# Altium schematic sheet USB Power.SchDoc: =SheetTitle
size A4; CompanyName: Catcatcat Electronics; Engineer: Hena Chernov; SheetNumber: 10; SheetTotal: 10; CodePhone: +380505759863; SheetDescription: Power, USB-bridge.; Email: catcatcat.electronics@gmail.com
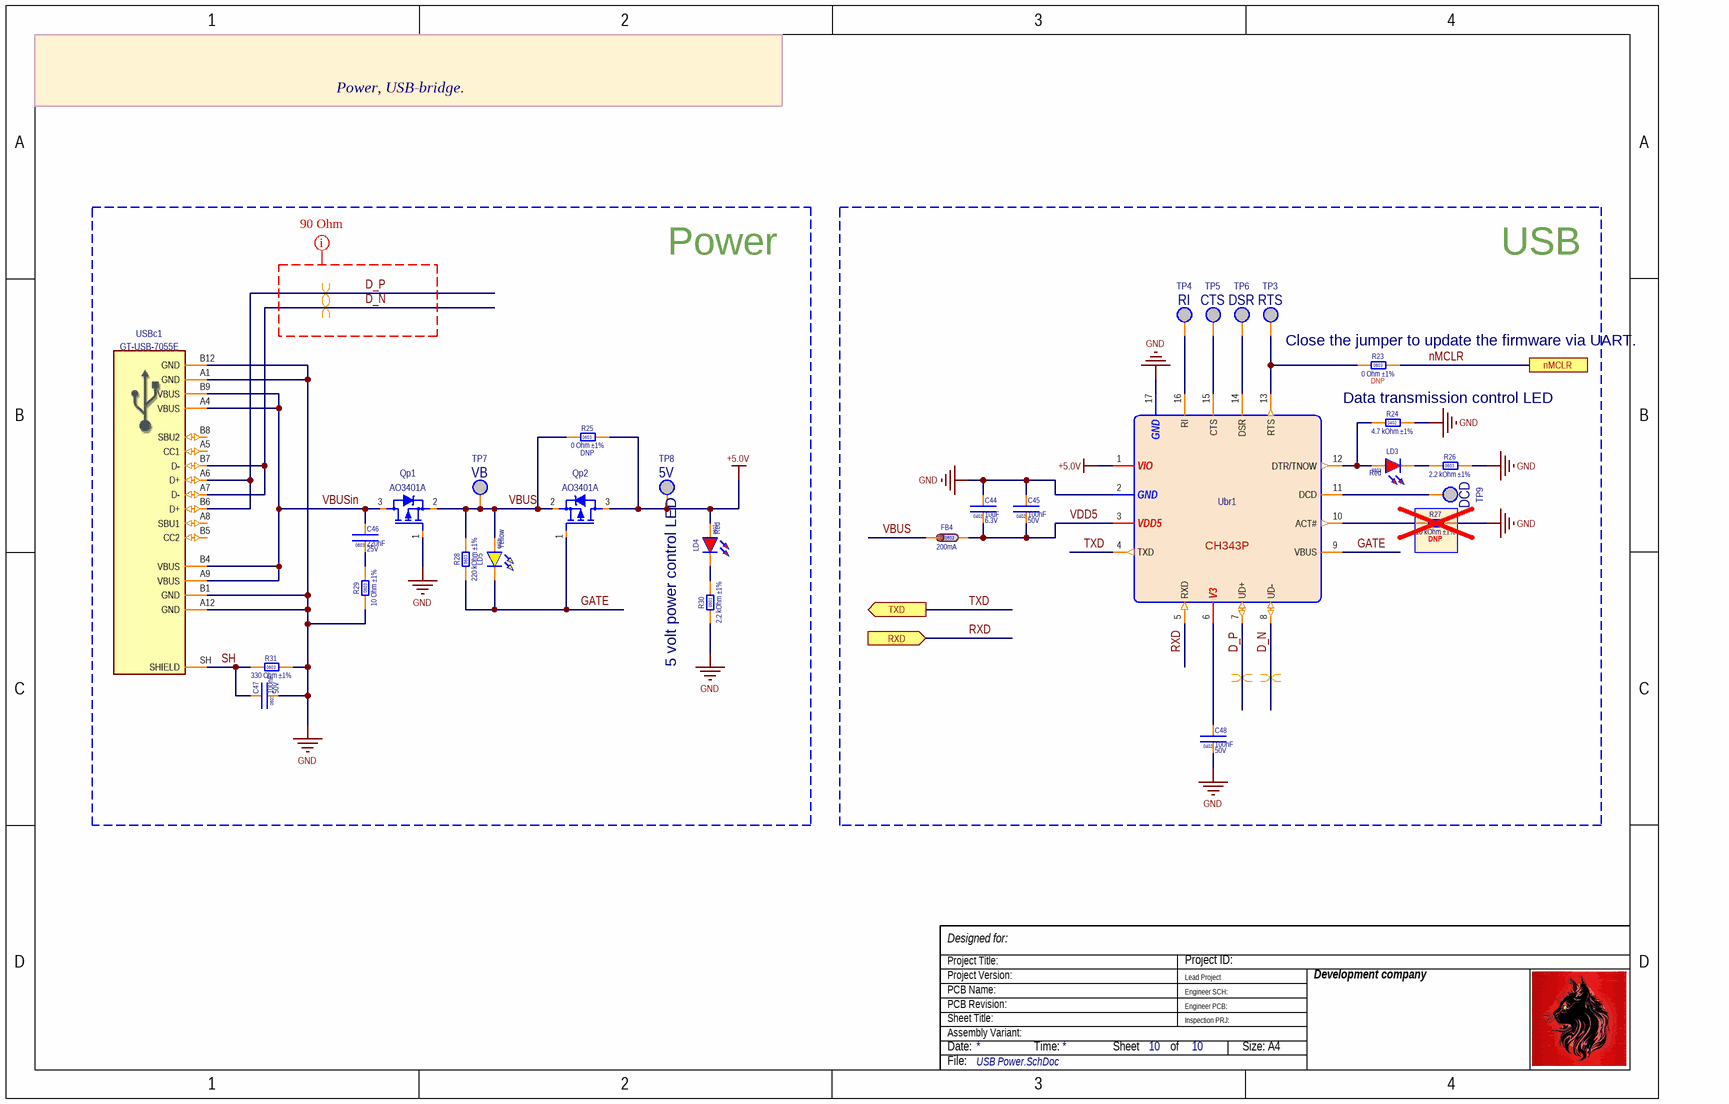
[diagram p0: USB Power.SchDoc]

## Parts
C44  value 10uF  Voltage: 6.3V  [CC0402(1005)x0.5]  (hidden comment: 10 uF 6.3V ±10%)
C45  value 100nF  Voltage: 50V  [CC0402(1005)x0.5]  (hidden comment: 100nF 50V ±10% 0402)
C46  value 220nF  Voltage: 25V  [CC0603(1608)x0.8]  (hidden comment: 0.22 uF ±10%)
C47  value 100nF  Voltage: 50V  [CC0603(1608)x0.8]  (hidden comment: 100 nF ±10% 50V)
C48  value 100nF  Voltage: 50V  [CC0402(1005)x0.5]  (hidden comment: 100nF 50V ±10% 0402)
FB4  value 200mA  [FB0603(1608)]  (hidden comment: GZ1608D601TF)
LD3  value Red  Case/Package: 0603  [LD0603 RED]  (hidden comment: KT-0603R)
LD4  value Red  Case/Package: 0603  [LD0603 RED]  (hidden comment: KT-0603R)
LD5  value Yellow  Case/Package: 0603  [LD0603 YELLOW]  (hidden comment: LED 0603 Yellow 120° 60mW)
Qp1  AO3401A  [FP-SOT23-IPC_C]
Qp2  AO3401A  [FP-SOT23-IPC_C]
R23  value 0 Ohm ±1%  Assembly type: DNP  [RC0603(1608)A J]  (hidden comment: 0R ±1% 0603)
R24  value 4.7 kOhm ±1%  [RC0402(1005)-1%]  (hidden comment: 4.7K ±1% 0402)
R25  value 0 Ohm ±1%  Assembly type: DNP  [RC0603(1608)A J]  (hidden comment: 0R ±1% 0603)
R26  value 2.2 kOhm ±1%  [RC0603(1608) -1%]  (hidden comment: 2.2K ±1% 0603)
R27  value 10 kOhm ±1%  Assembly type: DNP  [RC0402(1005)-1%]  (hidden comment: 10K ±1% 0402 50V)
R28  value 220 kOhm ±1%  [RC0603(1608) -1%]  (hidden comment: 220 K ±1%)
R29  value 10 Ohm ±1%  [RC0603(1608) -1%]  (hidden comment: 10R ±1% 0603)
R30  value 2.2 kOhm ±1%  [RC0603(1608) -1%]  (hidden comment: 2.2K ±1% 0603)
R31  value 330 Ohm ±1%  [RC0603(1608) -1%]  (hidden comment: 330 R ±1%)
TP3  RTS  [Test_Point_T_0.6mm]  (no BOM)
TP4  RI  [Test_Point_T_0.6mm]  (no BOM)
TP5  CTS  [Test_Point_T_0.6mm]  (no BOM)
TP6  DSR  [Test_Point_T_0.6mm]  (no BOM)
TP7  VB  [Test_Point_T_0.6mm]  (no BOM)
TP8  5V  [Test_Point_T_0.6mm]  (no BOM)
TP9  DCD  [Test_Point_T_0.6mm]  (no BOM)
Ubr1  CH343P  [TQFN-16-JLC]
USBc1  GT-USB-7055E  [TYPE-C16PIN-C7450622]

## Blocks framed on the sheet
Power: C46 C47 LD4 LD5 Qp1 Qp2 R25 R28-R31 TP7 TP8 USBc1
USB: C44 C45 C48 FB4 LD3 R23 R24 R26 R27 TP3-TP6 TP9 Ubr1

## Ports
nMCLR, RXD (in), TXD (out)

## Nets
+5.0V: LD4.2 Qp2.3(D) R25.2 TP8.1 Ubr1.1(VIO)
GND: C44.2 C45.2 C47.1 C48.1 Qp1.1(G) R24.2 R26.1 R27.2 R29.1 R30.1 R31.2 Ubr1.2(GND) Ubr1.17(GND) USBc1.A1(GND) USBc1.A12(GND) USBc1.B1(GND) USBc1.B12(GND)
D_N: Ubr1.8(UD-) USBc1.A7(D-) USBc1.B7(D-)
D_P: Ubr1.7(UD+) USBc1.A6(D+) USBc1.B6(D+)
GATE: LD5.1 Qp2.1(G) R28.1 Ubr1.9(VBUS)
nMCLR: R23.2 ; port nMCLR
RXD: Ubr1.5(RXD) ; port RXD
SH: C47.2 R31.1 USBc1.SH(SHIELD)
TXD: Ubr1.4(TXD) ; port TXD
VBUS: FB4.1 LD5.2 Qp1.2(S) Qp2.2(S) R25.1 R28.2 TP7.1
VBUSin: C46.2 Qp1.3(D) USBc1.A4(VBUS) USBc1.A9(VBUS) USBc1.B4(VBUS) USBc1.B9(VBUS)
VDD5: C44.1 C45.1 FB4.2 Ubr1.3(VDD5)
NetC46_1: C46.1 R29.2
NetC48_2: C48.2 Ubr1.6(V3)
NetLD3_1: LD3.1 R26.2
NetLD3_2: LD3.2 R24.1 Ubr1.12(DTR/TNOW)
NetLD4_1: LD4.1 R30.2
NetR23_1: R23.1 TP3.1 Ubr1.13(RTS)
NetR27_1: R27.1 Ubr1.10(ACT#)
NetTP4_1: TP4.1 Ubr1.16(RI)
NetTP5_1: TP5.1 Ubr1.15(CTS)
NetTP6_1: TP6.1 Ubr1.14(DSR)
NetTP9_1: TP9.1 Ubr1.11(DCD)

Not connected (* = marked no-connect by the designer): USBc1 A5(CC1) A8(SBU1) B5(CC2) B8(SBU2)

## Layout directives
differential pair: D_N, D_P
net class USB90Ohm: D_N, D_P

## Notes on the sheet
- Close the jumper to update the firmware via UART.
- Data transmission control LED
- (near TP8) 5 volt power control LED
- Project Title:
- Project Version:
- Designed for:
- Lead Project
- Project ID:
- Development company
- Date:
- PCB Revision:
- PCB Name:
- Sheet Title:
- Assembly Variant:
- Time:
- Sheet
- of
- Engineer SCH:
- Engineer PCB:
- Inspection PRJ:
- Size: A4
- File:

## Library data of the parts
C44 = 0402 10 uF 6.3V (B): 10 uF ±10% 6.3V X7R; Manufacturer 1: Samsung Electro-Mechanics; Manufacturer Part Number 1: CL05A106MQ5NUNC; Note: Ceramic Capacitors; Detailed Description: MULTILAYER CERAMIC CAPACITORS MLCC - SMD/SMT 10UF 6.3V 0402 ROHS; Case/Package: 0402; Publisher: Catcatcat Electronics; Tolerance: ±10 %; website developer: http://catcatcat.d-lan.dp.ua/; Supplier URL 1: https://jlcpcb.com/parts/componentSearch?searchTxt=; Operating Temperature: -55C to +125C; Supplier Part Number 1: C15525; Supplier Unit Price 1: 0.0052; Assembly type: Basic Part; Footprint check status: Verified; QuantityElements: 1; Supplier 1: LCSC; MountType: SMD
C45 C48 = 0402 0.1 uF 50V (B): 100 nF ±10% 50V X7R; Manufacturer 1: Guangdong Fenghua Advanced Tech; Manufacturer Part Number 1: CL05B104KB54PNC; Note: Ceramic Capacitors; Detailed Description: 50V 100nF X7R ±10% 0402 Multilayer Ceramic Capacitors MLCC - SMD/SMT ROHS; Case/Package: 0402; Publisher: Catcatcat Electronics; Tolerance: ±10 %; HelpURL: https://datasheet.lcsc.com/lcsc/1810191222_Samsung-Electro-Mechanics-CL05B104KB54PNC_C307331.pdf; website developer: http://catcatcat.d-lan.dp.ua/; Temperature Coefficient: X7R; Supplier URL 1: https://jlcpcb.com/parts/componentSearch?searchTxt=; Operating Temperature: -55C to +125C; Supplier Part Number 1: C307331; Supplier Unit Price 1: 0.0065; Assembly type: Basic Part; Footprint check status: Verified; QuantityElements: 1; Supplier 1: LCSC; MountType: SMD
C46 = 0603 0.22 uF 25V (B): 220 nF ±10% 25V X7R; Manufacturer 1: Samsung Electro-Mechanics; Manufacturer Part Number 1: CL10B224KA8NNNC; Note: Ceramic Capacitors; Detailed Description: 25V 220nF X7R ±10% 0603 Multilayer Ceramic Capacitors MLCC - SMD/SMT ROHS; Case/Package: 0603; Publisher: Catcatcat Electronics; Tolerance: ±10%; HelpURL: https://datasheet.lcsc.com/lcsc/1810261513_Samsung-Electro-Mechanics-CL10B224KA8NNNC_C21120.pdf; website developer: http://catcatcat.d-lan.dp.ua/; Temperature Coefficient: X7R; Supplier URL 1: https://jlcpcb.com/parts/componentSearch?searchTxt=; Operating Temperature: -55C to +125C; Supplier Part Number 1: C21120; Supplier Unit Price 1: 0.0045; Assembly type: Basic Part; Footprint check status: Verified; QuantityElements: 1; Supplier 1: LCSC; MountType: SMD
C47 = 0603 0.1 uF (B): 100 nF ±10% 50V X7R; Manufacturer 1: YAGEO; Manufacturer Part Number 1: CC0603KRX7R9BB104; Note: Ceramic Capacitors; Detailed Description: 50V 100nF X7R ±10% 0603  Multilayer Ceramic Capacitors MLCC - SMD/SMT ROHS; Case/Package: 0603; Publisher: Catcatcat Electronics; Tolerance: ±10%; HelpURL: https://datasheet.lcsc.com/lcsc/1809301912_YAGEO-CC0603KRX7R9BB104_C14663.pdf; website developer: http://catcatcat.d-lan.dp.ua/; Temperature Coefficient: X7R; Supplier URL 1: https://jlcpcb.com/parts/componentSearch?searchTxt=; Operating Temperature: -55C to +125C; Supplier Part Number 1: C14663; Supplier Unit Price 1: 0.0021; Assembly type: Basic Part; Footprint check status: Verified; QuantityElements: 1; Supplier 1: LCSC; MountType: SMD
FB4 = 0603 GZ1608D601TF (B): 0.20A 600 Ohm @100MHz 450 mOhm; Manufacturer 1: Sunlord; Temp.Characteristic: -55°C ~ 125°C; Note: Ferrite Beads and Chips; Detailed Description: 450mΩ ±25% 600Ω@100MHz 0603  Ferrite Beads ROHS; Case/Package: 0603; Publisher: Catcatcat Electronics; HelpURL: https://datasheet.lcsc.com/lcsc/1811091241_Sunlord-GZ1608D601TF_C1002.pdf; website developer: http://catcatcat.d-lan.dp.ua/; Manufacturer Part Number 1: GZ1608D601TF; Supplier URL 1: https://jlcpcb.com/parts/componentSearch?searchTxt=; Supplier Part Number 1: C1002; Supplier Unit Price 1: 0.0045; Assembly type: Basic Part; Footprint check status: Verified; QuantityElements: 1; Supplier 1: LCSC; MountType: SMD
LD3 LD4 = KT-0603R (B): 0603 Red 520~625NM 90~100MCD@20MA Top View RoHS; Manufacturer 1: Hubei KENTO Elec; Note: LED Red; Temp.Characteristic: -40C to +85C; Detailed Description: -40℃~+85℃ Red 0603  Light Emitting Diodes (LED) ROHS; Millicandela Rating: 30~50mcd@5mA; Wavelength(Range or typical): 619~625nm; Publisher: Catcatcat Electronics; Manufacturer Part Number 1: KT-0603R; Supplier URL 1: https://www.lcsc.com/product-detail/Light-Emitting-Diodes-LED_Hubei-KENTO-Elec-KT-0603R_C2286.html; Operating Temperature: -40°C~+85°C; Supplier Part Number 1: C2286; Supplier Unit Price 1: 0.0053; HelpURL: https://datasheet.lcsc.com/szlcsc/Hubei-KENTO-Elec-KT-0603R_C2286.pdf; Website developer: http://catcatcat.d-lan.dp.ua/; Assembly type: Basic Part; Footprint check status: Verified; QuantityElements: 1; Supplier 1: LCSC; MountType: SMD
LD5 = 19-213/Y2C-CQ2R2L/3T(CY) (B): 0603 Yellow Colorless transparence -40℃~+85℃ 585.5nm~591.5nm yellow 120° 60mW 0603  Light Emitting Diodes (LED) ROHS; Manufacturer 1: Everlight Elec; Temp.Characteristic: -40C to +85C; Millicandela Rating: 90~180mcd@20mA; Wavelength(Range or typical): 585.5~591.5nm; Publisher: Catcatcat Electronics; Note: Light Emitting Diodes; Manufacturer Part Number 1: 19-213/Y2C-CQ2R2L/3T(CY); Detailed Description: Colorless transparence -40℃~+85℃ 585.5nm~591.5nm yellow 120° 60mW 0603  Light Emitting Diodes (LED) ROHS; Supplier URL 1: https://www.lcsc.com/product-detail/Light-Emitting-Diodes-LED_Everlight-Elec-19-213-Y2C-CQ2R2L-3T-CY_C72038.html; Supplier Part Number 1: C72038; Supplier Unit Price 1: 0.0195; HelpURL: https://datasheet.lcsc.com/lcsc/1810101813_Everlight-Elec-19-213-Y2C-CQ2R2L-3T-CY_C72038.pdf; Website developer: http://catcatcat.d-lan.dp.ua/; Assembly type: Basic Part; Footprint check status: Verified; QuantityElements: 1; Supplier 1: LCSC; MountType: SMD
Qp1 Qp2 = AO3401A (B): P-Channel SOT-23-3L 30V 4A 44mΩ@10V,4.3A 1.4W 1.3V@250uAl SOT-23-3L  MOSFETs ROHS; Manufacturer 1: Alpha & Omega Semicon; Note: Transistor; Temp.Characteristic: -40C to +85C; Voltage: 30V 4A; Detailed Description: 30V 4A 44mΩ@10V,4.3A 1.4W P Channel SOT-23  MOSFETs ROHS; Supplier Unit Price 1: 0.0591; Publisher: Catcatcat Electronics; Supplier URL 1: https://www.lcsc.com/product-detail/MOSFETs_Alpha-Omega-Semicon-AO3401A_C15127.html; HelpURL: https://datasheet.lcsc.com/szlcsc/Alpha-Omega-Semicon-AOS-AO3401A_C15127.pdf; Manufacturer Part Number 1: AO3401A; Website Developer: http://catcatcat.d-lan.dp.ua/; Operating Temperature: -55℃~+150℃@(Tj); Case/Package: SOT-23-3L; Supplier Part Number 1: C15127; Assembly type: Basic Part; Footprint check status: Verified; Current: 4A; QuantityElements: 1; Supplier 1: LCSC; MountType: SMD; Value: AO3401A
R23 R25 = 0603 0 Ohm ±1% (B): 0 R (000) ±5% 1/10W 50V; Manufacturer 1: Uniroyal Elec; Manufacturer Part Number 1: 0603WAF0000T5E; Note: Chip Resistor - Surface Mount; Temperature Coefficient: ±100ppm/°C; Detailed Description: CHIP RESISTOR - SURFACE MOUNT 0OHMS ±1% 1/10W 0603 ROHS; Publisher: Catcatcat Electronics; Tolerance: ±1%; Voltage: 50V; HelpURL: https://datasheet.lcsc.com/szlcsc/Uniroyal-Elec-0603WAF0000T5E_C21189.pdf; Website Developer: http://catcatcat.d-lan.dp.ua/; Power (Watts): 1/10W; Supplier URL 1: https://jlcpcb.com/parts/componentSearch?searchTxt=; Operating Temperature: -55°C ~ 155°C; Supplier Part Number 1: C21189; Supplier Unit Price 1: 0.0016; Footprint check status: Verified; QuantityElements: 1; Supplier 1: LCSC; MountType: SMD; Case/Package: 0603
R24 = 0402 4.7 kOhm ±1% (B): 4.7 k (4701)±1% 1/16W 50V; Manufacturer 1: UNI-ROYAL(Uniroyal Elec); Manufacturer Part Number 1: 0402WGF4701TCE; Note: Chip Resistor - Surface Mount; Temperature Coefficient: ±100ppm/℃; Detailed Description: ±1% 1/16W Thick Film Resistors 50V ±100ppm/℃ -55℃~+155℃ 4.7kΩ 0402 Chip Resistor - Surface Mount ROHS; Publisher: Catcatcat Electronics; Tolerance: ±1%; Voltage: 50V; HelpURL: Uniroyal-Elec-0402WGF4701TCE_C25900.pdf; Website Developer: http://catcatcat.d-lan.dp.ua/; Power (Watts): 1/16W; Supplier URL 1: https://jlcpcb.com/parts/componentSearch?searchTxt=C25900; Operating Temperature: -55°C ~ 155°C; Supplier Part Number 1: C25900; Supplier Unit Price 1: 0.0005; Assembly type: Basic Part; Footprint check status: Verified; QuantityElements: 1; Supplier 1: LCSC; MountType: SMD; Case/Package: 0402
R26 R30 = 0603 2.2 kOhm ±1% (B): 2.2 k (222) ±1% 1/10W 50V; Manufacturer 1: Uniroyal Elec; Manufacturer Part Number 1: 0603WAF2201T5E; Note: Chip Resistor - Surface Mount; Marking: 222; Temperature Coefficient: ±100ppm/℃; Detailed Description: 100mW Thick Film Resistors ±100ppm/℃ ±1% 2.2kΩ 0603  Chip Resistor - Surface Mount ROHS; Publisher: Catcatcat Electronics; Tolerance: ±1%; Voltage: 50V; HelpURL: https://datasheet.lcsc.com/szlcsc/Uniroyal-Elec-0603WAF2201T5E_C4190.pdf; Website Developer: http://catcatcat.d-lan.dp.ua/; Power (Watts): 1/10W; Supplier URL 1: https://jlcpcb.com/parts/componentSearch?searchTxt=; Operating Temperature: -55°C ~ 155°C; Supplier Part Number 1: C4190; Supplier Unit Price 1: 0.0009; Assembly type: Basic Part; Footprint check status: Verified; QuantityElements: 1; Supplier 1: LCSC; MountType: SMD; Case/Package: 0603
R27 = 0402 10 kOhm ±1% (B): 10 k ±1% 1/16W 50V; Manufacturer 1: Uniroyal Elec; Manufacturer Part Number 1: 0402WGF1002TCE; Note: Chip Resistor - Surface Mount; Temperature Coefficient: ±100ppm/°C; Detailed Description: 62.5mW Thick Film Resistors ±100ppm/℃ ±1% 10kΩ 0402  Chip Resistor - Surface Mount ROHS; Publisher: Catcatcat Electronics; Tolerance: ±1%; Voltage: 50V; HelpURL: https://datasheet.lcsc.com/szlcsc/Uniroyal-Elec-0402WGF1002TCE_C25744.pdf; Website Developer: http://catcatcat.d-lan.dp.ua/; Power (Watts): 1/16W; Supplier URL 1: https://jlcpcb.com/parts/componentSearch?searchTxt=C25744; Operating Temperature: -55°C ~ 155°C; Supplier Part Number 1: C25744; Supplier Unit Price 1: 0.0004; Footprint check status: Verified; QuantityElements: 1; Supplier 1: LCSC; MountType: SMD; Case/Package: 0402
R28 = 0603 220 kOhm ±1% (B): 220 k (224) ±5% 1/10W 50V; Manufacturer 1: Uniroyal Elec; Manufacturer Part Number 1: 0603WAF2203T5E; Note: Chip Resistor - Surface Mount; Marking: 224; Temperature Coefficient: ±100ppm/°C; Detailed Description: CHIP RESISTOR - SURFACE MOUNT 220KOHMS ±1% 1/10W 0603 ROHS; Publisher: Catcatcat Electronics; Tolerance: ±1%; Voltage: 50V; HelpURL: https://datasheet.lcsc.com/szlcsc/Uniroyal-Elec-0603WAF1603T5E_C22813.pdf; Website Developer: http://catcatcat.d-lan.dp.ua/; Power (Watts): 1/10W; Supplier URL 1: https://jlcpcb.com/parts/componentSearch?searchTxt=; Operating Temperature: -55°C ~ 155°C; Supplier Part Number 1: C22961; Supplier Unit Price 1: 0.0016; Assembly type: Basic Part; Footprint check status: Verified; QuantityElements: 1; Supplier 1: LCSC; MountType: SMD; Case/Package: 0603
R29 = 0603 10 Ohm ±1% (B): 10 R (XIO) ±1% 1/10W 50V ±400ppm/°C; Manufacturer 1: Uniroyal Elec; Manufacturer Part Number 1: 0603WAF100JT5E; Note: Chip Resistor - Surface Mount; Detailed Description: 100mW Thick Film Resistors ±1% ±400ppm/℃ 10Ω 0603  Chip Resistor - Surface Mount ROHS; Publisher: Catcatcat Electronics; Tolerance: ±1%; Voltage: 50V; HelpURL: https://datasheet.lcsc.com/szlcsc/Uniroyal-Elec-0603WAF100JT5E_C22859.pdf; Website Developer: http://catcatcat.d-lan.dp.ua/; Temperature Coefficient: ±400ppm/°C; Power (Watts): 1/10W; Supplier URL 1: https://jlcpcb.com/parts/componentSearch?searchTxt=C22859; Operating Temperature: -55°C ~ 155°C; Supplier Part Number 1: C22859; Supplier Unit Price 1: 0.0009; Assembly type: Basic Part; Footprint check status: Verified; QuantityElements: 1; Supplier 1: LCSC; MountType: SMD; Case/Package: 0603
R31 = 0603 330 Ohm ±1% (B): 330 R (331) ±5% 1/10W 50V; Manufacturer 1: Uniroyal Elec; Manufacturer Part Number 1: 0603WAF3300T5E; Note: Chip Resistor - Surface Mount; Temperature Coefficient: ±100ppm/°C; Detailed Description: CHIP RESISTOR - SURFACE MOUNT 330OHMS ±1% 1/10W 0603 ROHS; Publisher: Catcatcat Electronics; Tolerance: ±1%; Voltage: 50V; HelpURL: https://datasheet.lcsc.com/szlcsc/Uniroyal-Elec-0603WAF3300T5E_C23138.pdf; Website Developer: http://catcatcat.d-lan.dp.ua/; Power (Watts): 1/10W; Supplier URL 1: https://jlcpcb.com/parts/componentSearch?searchTxt=; Manufacturer URL: http://uniohm.com/; Operating Temperature: -55°C ~ 155°C; Supplier Part Number 1: C23138; Supplier Unit Price 1: 0.0019; Assembly type: Basic Part; Footprint check status: Verified; QuantityElements: 1; Supplier 1: LCSC; MountType: SMD; Case/Package: 0603
TP3-TP9 = Test_Point smd_0.6: Test Point TOP; Value: SMD; Assembly type: Test Point; Note: Test Point; Publisher: Catcatcat Electronics; Website developer: http://catcatcat.d-lan.dp.ua/; Footprint check status: Verified; Supplier URL 1: https://jlcpcb.com/parts/componentSearch?searchTxt=; Supplier 1: LCSC
Ubr1 = CH343P (E): USB Bridge, USB 2.0 Transceiver 2Mbps TQFN-16-EP(3x3); Manufacturer 1: WCH(Jiangsu Qin Heng); Detailed Description: USB 2.0 Transceiver 2Mbps SOP-16_150mil USB ICs ROHS; Supplier URL 1: https://jlcpcb.com/parts/componentSearch?searchTxt=C2846043; Publisher: Catcatcat Electronics; Note: USB; HelpURL: https://datasheet.lcsc.com/lcsc/2108172330_WCH-Jiangsu-Qin-Heng-CH343P_C2846043.pdf; Manufacturer Part Number 1: CH343P; Website Developer: http://catcatcat.d-lan.dp.ua/; Case/Package: TQFN-16-EP(3x3); Supplier Part Number 1: C2846043; Supplier Unit Price 1: 1.1284; Assembly type: Extended Part; Footprint check status: Verified; QuantityElements: 1; Supplier 1: LCSC; MountType: SMD; Value: CH343P
USBc1 = GT-USB-7055E (E): Type C V USB 2.0 5A 1 Brick nogging 16P Female -40℃~+85℃ Gold High Conductivity Copper Type-C SMD  USB Connectors ROHS; Manufacturer 1: G-Switch; Note: DIP+SMD USB Connectors RoHS; Temp.Characteristic: -20C to +70C; HelpURL: https://wmsc.lcsc.com/wmsc/upload/file/pdf/v2/lcsc/2307121106_G-Switch-GT-USB-7055E_C7450622.pdf; Publisher: Catcatcat Electronics; Manufacturer Part Number 1: GT-USB-7055E; Website developer: http://catcatcat.d-lan.dp.ua/; Detailed Description: USB 2.0 5A 1 Brick nogging 16P Female -40℃~+85℃ Gold High Conductivity Copper Type-C SMD  USB Connectors ROHS; Assembly type: Extended Part; Supplier URL 1: https://www.lcsc.com/product-detail/USB-Connectors_G-Switch-GT-USB-7055E_C7450622.html; Case/Package: SMD; Supplier Part Number 1: C7450622; Supplier Unit Price 1: 0.2603; Footprint check status: Verified; QuantityElements: 1; Supplier 1: LCSC; MountType: SMT/TH; Value: GT-USB-7055E